# EAGLE design gps (EAGLE 9.3.0)
AUTHOR: PY2RAF; REVISION: A
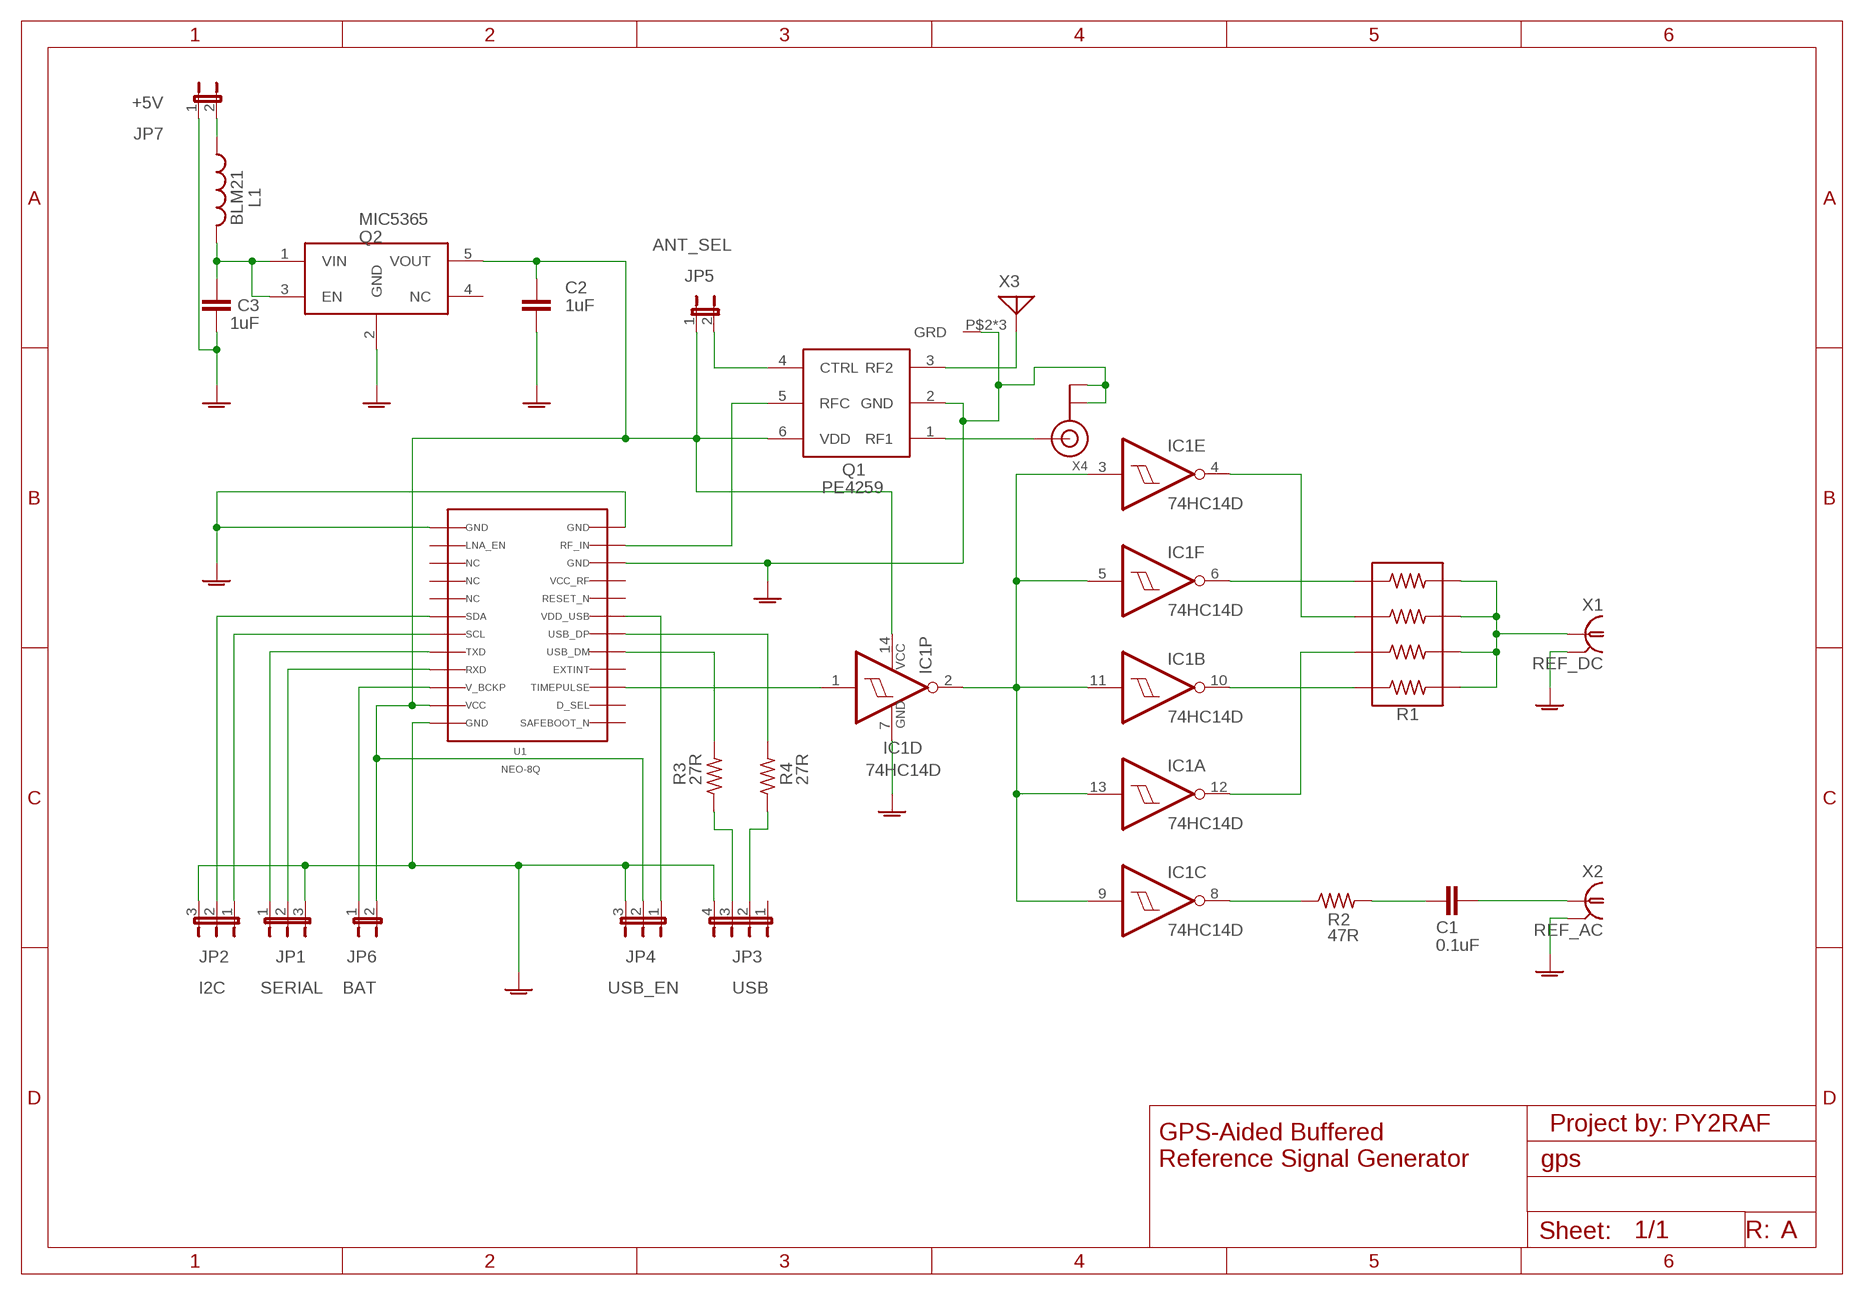
[diagram p0: schematic, sheet 1]

## Parts
C1  0.1uF  C-EUC1206  [C1206]
C2  1uF  C-EUC1206  [C1206]
C3  1uF  C-EUC1206  [C1206]
IC1  74HC14D  [SO14]
JP1  SERIAL  JP2E  [JP2]
JP2  I2C  JP2E  [JP2]
JP3  USB  JP4E  [JP4]
JP4  USB_EN  JP2E  [JP2]
JP5  ANT_SEL  JP1E  [JP1]
JP6  BAT  JP1E  [JP1]
JP7  +5V  JP1E  [JP1]
L1  BLM21  L-USL2012C  [L2012C]
Q1  PE4259  [SC-70]
Q2  MIC5365  [SOT23-5L]
R1  744C083  [1206X4]
R2  47R  R-US_M1206  [M1206]
R3  27R  R-US_M1206  [M1206]
R4  27R  R-US_M1206  [M1206]
U1  NEO-8Q  NEO-8  [NEO-7]
X1  REF_DC  SMA-PCB  [SMA-RF]
X2  REF_AC  SMA-PCB  [SMA-RF]
X3  ANT-GNSS-MLX  [MOLEX-GNSS]
X4  ANTENNA_U.FL  [U.FL]

## Nets
GNDA: C2.2 C3.2 IC1.7(P:GND) JP1.3 JP2.3 JP3.4 JP4.3 JP7.1 Q1.2(GND) Q2.2(GND) U1.10 U1.12 U1.13 U1.24 X1.2 X1.3 X1.4 X1.5 X2.2 X2.3 X2.4 X2.5 X3.P$2(GRD) X3.P$3(GRD) X3.P$4(GRD) X4.1(GND) X4.2(GND)
N$1: IC1.2(D:O) IC1.3(E:I) IC1.5(F:I) IC1.9(C:I) IC1.11(B:I) IC1.13(A:I)
N$2: IC1.4(E:O) R1.P$3
N$3: IC1.12(A:O) R1.P$2
N$4: IC1.10(B:O) R1.P$1
N$5: IC1.6(F:O) R1.P$4
N$6: IC1.1(D:I) U1.3
N$7: IC1.8(C:O) R2.1
N$8: C1.2 R2.2
N$9: R3.2 U1.5
N$10: R4.2 U1.6
N$11: C1.1 X2.1
N$12: JP4.1 U1.7
N$13: JP3.3 R3.1
N$14: JP3.2 R4.1
N$15: JP2.2 U1.18
N$16: JP2.1 U1.19
N$17: JP1.2 U1.21
N$18: JP1.1 U1.20
N$19: JP6.1 U1.22
N$20: JP5.2 Q1.4(CTRL)
N$21: R1.P$5 R1.P$6 R1.P$7 R1.P$8 X1.1
N$22: C2.1 IC1.14(P:VCC) JP4.2 JP5.1 JP6.2 Q1.6(VDD) Q2.5(VOUT) U1.23
N$23: Q1.5(RFC) U1.11
N$24: C3.1 L1.2 Q2.1(VIN) Q2.3(EN)
N$25: JP7.2 L1.1
N$26: Q1.3(RF2) X3.P$1(ANT)
N$27: Q1.1(RF1) X4.3(SIGNAL)
Unconnected: JP3.1 Q2.4(NC) U1.1 U1.2 U1.4 U1.8 U1.9 U1.14 U1.15 U1.16 U1.17

## Notes on the sheet
- Project by:
- GPS-Aided Buffered
  Reference Signal Generator
- R:

## Library data of the parts
C1-C3 = rcl:C-EU: CAPACITOR, European symbol; SPICEPREFIX: C
IC1 = 74xx-eu:74*14: Hex schmitt trigger INVERTER
JP1 JP2 JP4 = jumper:JP2E: JUMPER
JP3 = jumper:JP4E: JUMPER
JP5-JP7 = jumper:JP1E: JUMPER
L1 = rcl:L-US: INDUCTOR, American symbol; SPICEPREFIX: L
Q1 = aarf:PE4259: PE4259 SPDT High Power UltraCMOS 10 MHz 3.0 GHz RF Switch Features - High ESD tolerance of 2 kV HBM - Single-pin or complementary CMOS logic control inputs - Low insertion loss: * 0.35 dB @ 1000 MHz * 0.5 dB @ 2000 MHz - Isolation of 30 dB @ 1000 MHz - Typical input 1 dB compression point of +33.5 dBm - 1.8V minimum power supply voltage - Ultra-small SC-70 package
Q2 = aarf:MIC5365
R1 = aarf:744C083
R2-R4 = rcl:R-US_: RESISTOR, American symbol; SPICEPREFIX: R
U1 = aarf:NEO-8
X1 X2 = aarf:SMA-PCB
X3 = aarf:ANT-GNSS-MLX
X4 = adafruit:ANTENNA_U.FL: U.FL Antenna Connector

## Board
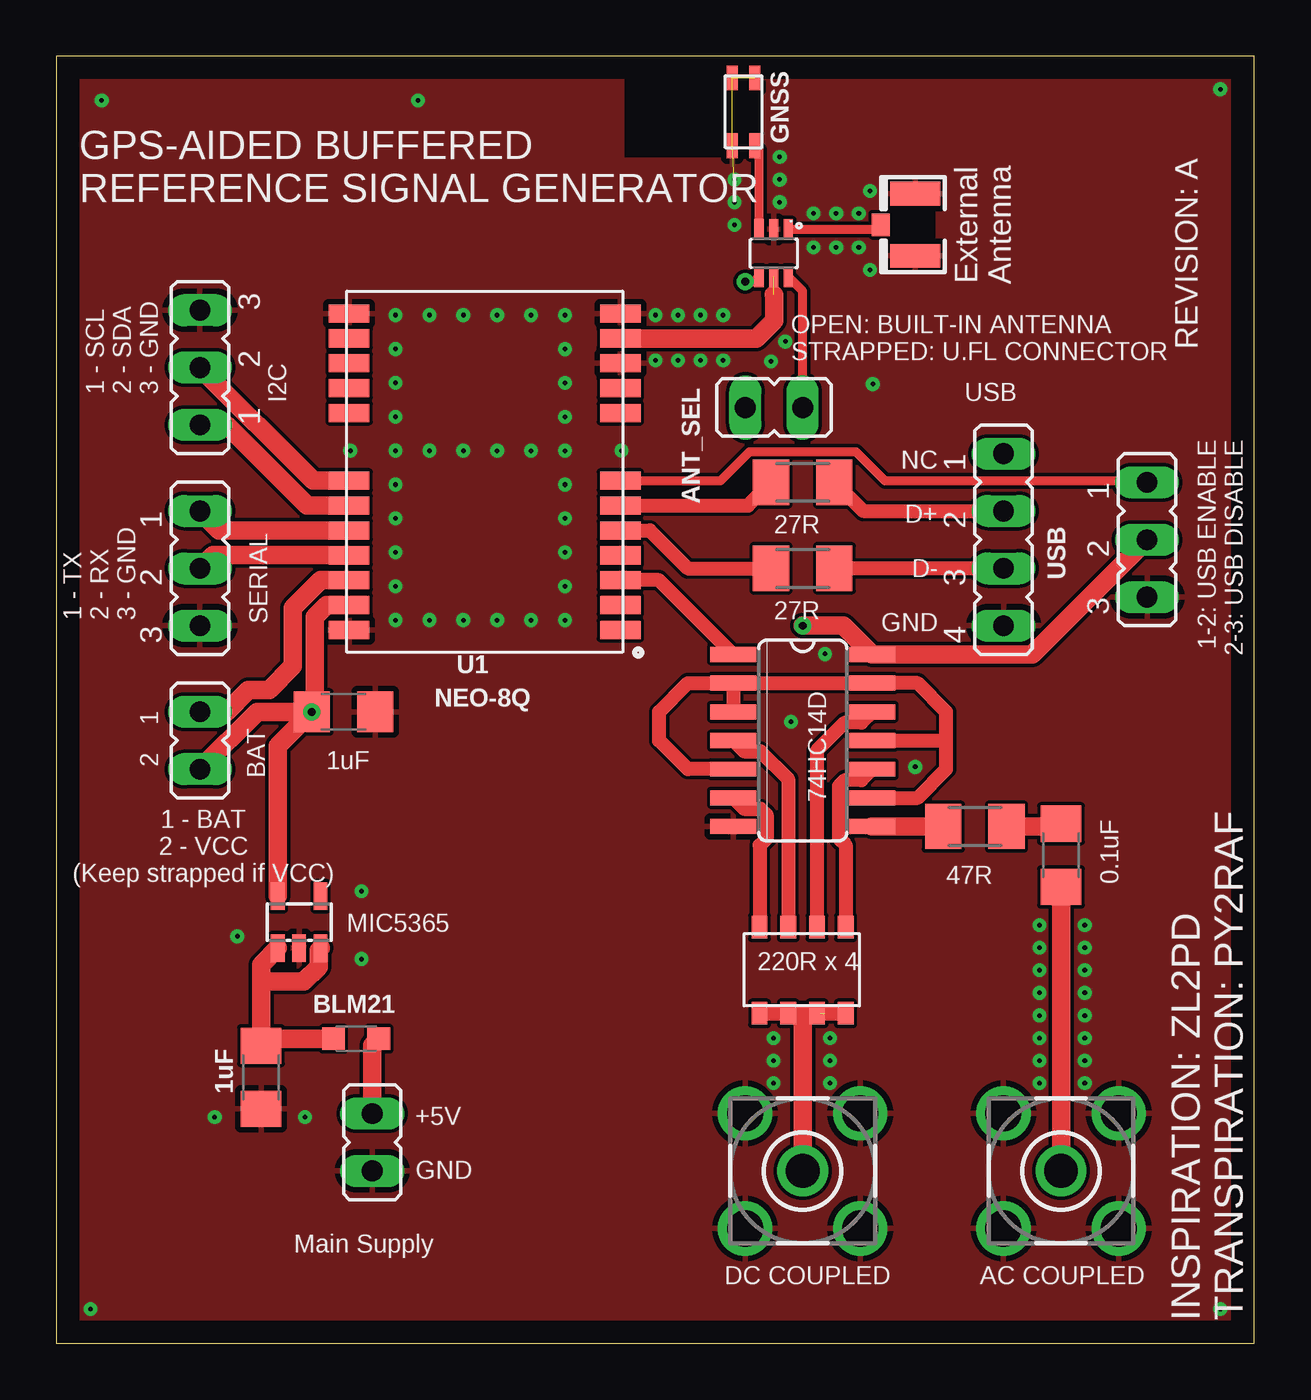
[diagram p1: board, top side]
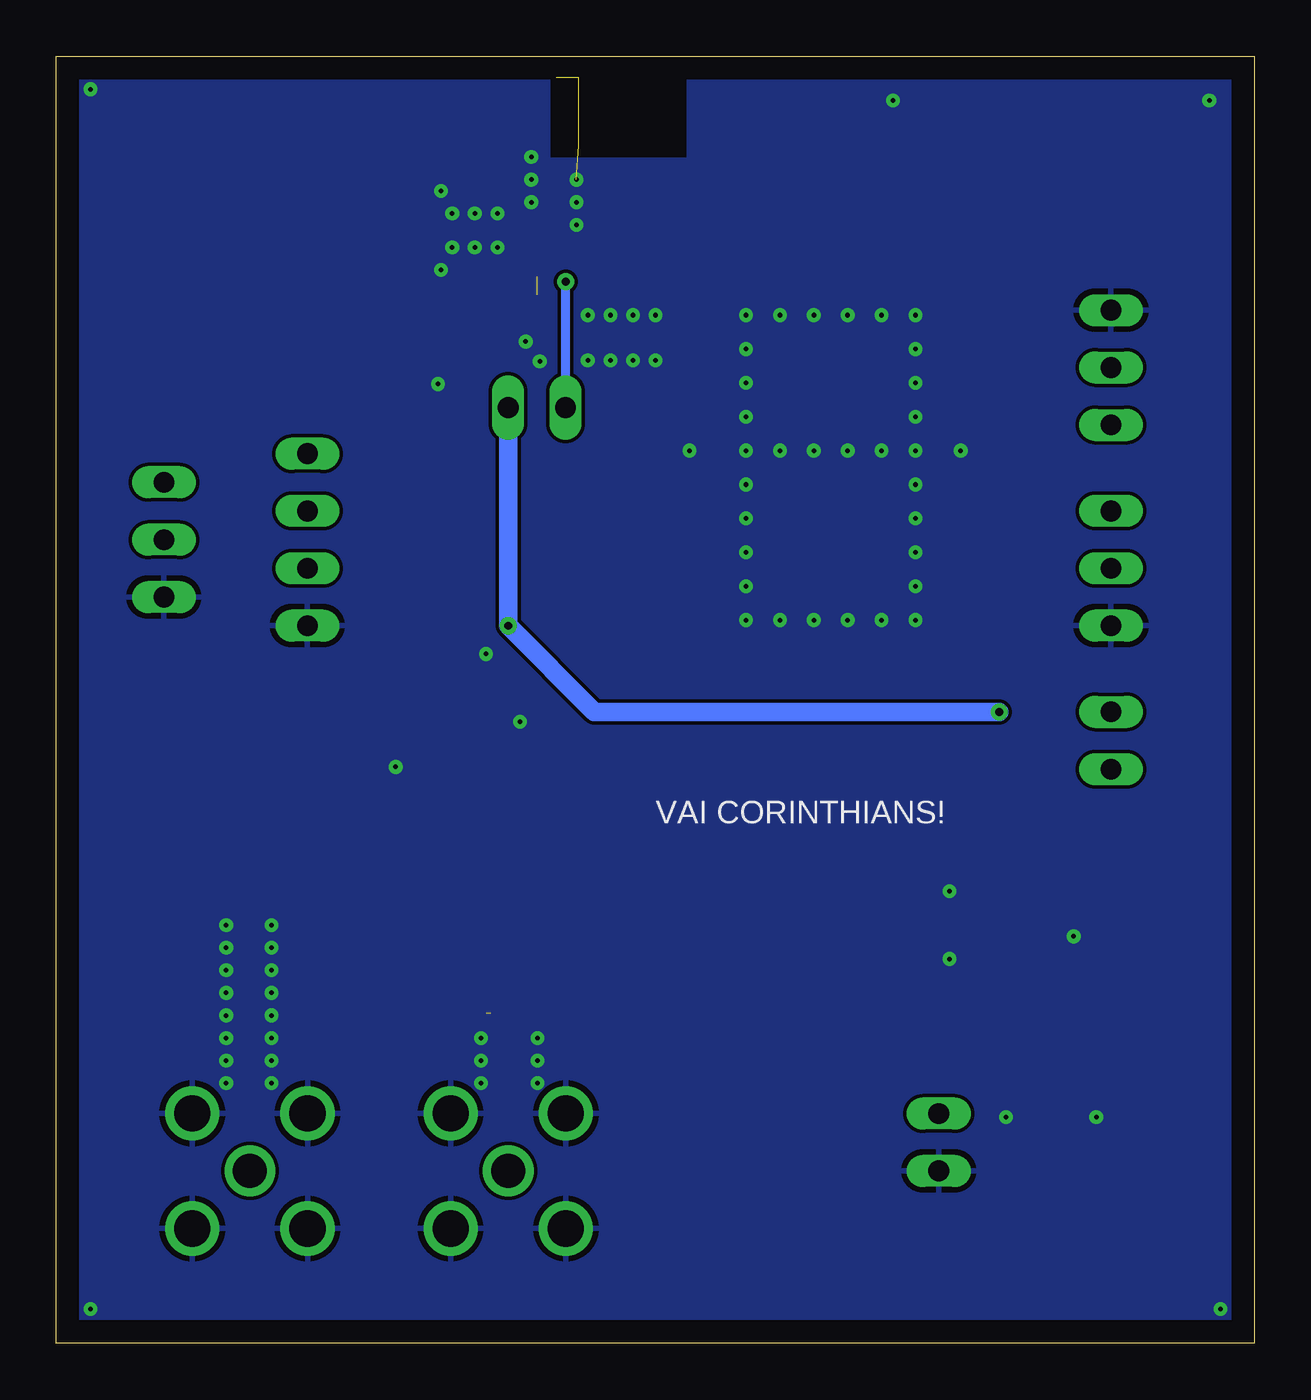
[diagram p2: board, bottom side, seen from below]

Size 53.01 x 56.95 mm. Coordinates in mm from the lower left corner, seen from the top.
Outline: 0,0 53.01,0 53.01,56.95 0,56.95 0,0
Copper layers (1*16): Top 0.035mm / dielectric 1.5mm / Bottom 0.035mm
Design rules "default *": minimum track width 6mil, minimum drill 0.35mm, track to track 6mil, track to pad 6mil, pad to pad 6mil, via to via 6mil, smd to smd 6mil, copper to edge 40mil, drill to drill 6mil, minimum pad ring 10mil, minimum via ring 8mil, stop-mask expansion 4mil, vias tented up to drill 10mil, thermal gap 10mil
tRestrict: area 25.1,52.5 to 31.1,56.5
bRestrict: area 25.1,52.5 to 31.1,56.5

### Footprints (pad centres in the part's own frame; a part is rotated, then mirrored left to right if it is on the bottom)
C1206 = smd 1.6 x 1.8: 1 -1.4,0; 2 1.4,0
SO14 = smd 0.66 x 2.032: 1 -3.81,-3.073; 2 -2.54,-3.073; 3 -1.27,-3.073; 4 0,-3.073; 5 1.27,-3.073; 6 2.54,-3.073; 7 3.81,-3.073; 8 3.81,3.073; 9 2.54,3.073; 10 1.27,3.073; 11 0,3.073; 12 -1.27,3.073; 13 -2.54,3.073; 14 -3.81,3.073
JP2 = drill 0.914 long: 1 -2.54,0; 2 0,0; 3 2.54,0
JP4 = drill 0.914 long: 1 -3.81,0; 2 -1.27,0; 3 1.27,0; 4 3.81,0
JP1 = drill 0.914 long: 1 0,-1.27; 2 0,1.27
L2012C = smd 1 x 1: 1 -1,0; 2 1,0
SC-70 = smd 0.4 x 0.9: 1 -0.635,-1.035; 2 0.015,-1.035; 3 0.665,-1.035; 4 0.665,1.065; 5 0.015,1.065; 6 -0.635,1.065
SOT23-5L = smd 0.6 x 1.2: 1 -0.95,-1.15; 2 0,-1.15; 3 0.95,-1.15; 4 0.95,1.15; 5 -0.95,1.15
1206X4 = smd 0.7 x 1: P$1 -1.9,-1.9; P$2 -0.63,-1.9; P$3 0.64,-1.9; P$4 1.91,-1.9; P$5 1.91,1.91; P$6 0.64,1.91; P$7 -0.63,1.91; P$8 -1.9,1.91
M1206 = smd 1.6 x 2: 1 -1.4,0; 2 1.4,0
NEO-7 = smd 1.8 x 0.8: 1 5.9,-7.8; 2 5.9,-6.7; 3 5.9,-5.6; 4 5.9,-4.5; 5 5.9,-3.4; 6 5.9,-2.3; 7 5.9,-1.2; 8 5.9,1.8; 9 5.9,2.9; 10 5.9,4; 11 5.9,5.1; 12 5.9,6.2; 13 -6.1,6.2; 14 -6.1,5.1; 15 -6.1,4; 16 -6.1,2.9; 17 -6.1,1.8; 18 -6.1,-1.2; 19 -6.1,-2.3; 20 -6.1,-3.4; 21 -6.1,-4.5; 22 -6.1,-5.6; 23 -6.1,-6.7; 24 -6.1,-7.8
SMA-RF = drill 1.5: 1 0,0 | drill 1.6: 2 -2.55,2.55; 3 2.55,2.55; 4 2.55,-2.55; 5 -2.55,-2.55
MOLEX-GNSS = smd 1.1 x 0.5: P$1 -1.5,-0.4; P$2 -1.5,0.6; P$3 1.5,0.6; P$4 1.5,-0.4
U.FL = smd 2.2 x 1.05: 1 0,1.375; 2 0,-1.375 | smd 0.8 x 1: 3 1.525,0

### Placement (x,y rotation side)
C1  44.45,21.59 90 top
C2  12.7,27.94 0 top
C3  9.05,11.76 270 top
IC1  33.02,26.67 270 top
JP1  6.35,34.29 270 top
JP2  6.35,43.18 90 top
JP3  41.91,35.56 270 top
JP4  48.26,35.56 270 top
JP5  31.75,41.41 90 top
JP6  6.35,26.67 180 top
JP7  13.97,8.89 0 top
L1  13.26,13.47 180 top
Q1  31.75,48.26 180 top
Q2  10.74,18.63 0 top
R1  33.02,16.51 180 top
R2  40.64,22.86 0 top
R3  33.02,34.29 180 top
R4  33.02,38.1 180 top
U1  19.05,39.37 0 top
X1  33.02,7.62 0 top
X2  44.45,7.62 0 top
X3  30.5,54.5 90 top
X4  38,49.5 180 top

### Tracks (layer width: path | path; a pad name or v marks a point on that pad's centre or on a via)
GNDA  (via drill 0.2)  (3 unrouted)
  other vias: 26.5,45.5 26.5,43.5 27.5,43.5 28.5,43.5 28.5,45.5 27.5,45.5 29.5,45.5 29.5,43.5 36.12,42.45 30,49.5 30,50.5 30,51.5 32,51.5 32,50.5 33.5,50 34.5,50 34.5,48.5 33.5,48.5 15,45.5 15,44 15,42.5 15,41 15,39.5 15,38 15,36.5 15,35 15,33.5 15,32 16.5,32 18,32 19.5,32 21,32 22.5,32 22.5,33.5 22.5,35 22.5,36.5 22.5,38 22.5,39.5 22.5,41 22.5,42.5 22.5,44 22.5,45.5 21,45.5 19.5,45.5 18,45.5 16.5,45.5 25,39.5 13,39.5 45.5,18.5 45.5,17.5 45.5,16.5 45.5,15.5 45.5,14.5 45.5,13.5 45.5,12.5 45.5,11.5 43.5,11.5 43.5,12.5 43.5,13.5 43.5,14.5 43.5,15.5 43.5,16.5 43.5,17.5 43.5,18.5 31.73,13.5 31.73,12.5 31.73,11.5 34.23,11.5 34.23,12.5 34.23,13.5 16.5,39.5 18,39.5 19.5,39.5 21,39.5 32.5,27.5 34,30.5 13.5,17 13.5,20 2,55 16,55 35.5,50 35.5,48.5 51.5,55.5 51.5,1.5 1.5,1.5 31.62,43.45 32.25,44.33 36,47.5 36,51 32,52.5 7,10 11,10 8,18 38,25.5
  pour Top: 0,56.96 0,0 53.34,0 53.34,56.96
  pour Bottom: 0,56.96 0,0 53.34,0 53.34,56.96
N$1
  Top 0.61: IC1.2 IC1.3 | IC1.2 IC1.13 38.1,29.21 39.37,27.94 39.37,26.67 | IC1.9 38.1,24.13 39.37,25.4 39.37,26.67 | IC1.11 39.37,26.67 | IC1.5 27.94,25.4 26.67,26.67 26.67,27.94 27.94,29.21 IC1.2
N$2
  Top 0.61: IC1.4 30.43,26.19 31.15,26.19 32.38,24.96 R1.P$3
N$3
  Top 0.61: IC1.12 35.61,27.46 34.89,27.46 33.65,26.22 R1.P$2
N$4
  Top 0.61: IC1.10 35.61,24.92 34.89,24.92 34.62,24.65 34.62,22.34 34.92,22.04 R1.P$1
N$5
  Top 0.61: IC1.6 30.43,23.65 31.15,23.65 31.42,23.38 31.42,22.34 31.11,22.03 R1.P$4
N$6
  Top 0.61: IC1.1 26.66,33.77 U1.3
N$7
  Top 0.813: IC1.8 R2.1
N$8
  Top 0.61: R2.2 42.17,22.99
  Top 0.813: R2.2 44.32,22.86 C1.2
N$9
  Top 0.61: U1.5 26.26,35.97 27.94,34.29 R3.2
N$10
  Top 0.61: U1.6 30.59,37.07 R4.2
N$11
  Top 0.813: X2.1 C1.1
N$12
  Top 0.406: JP4.1 48.19,38.17 36.65,38.17 35.37,39.46 30.67,39.46 29.39,38.17 U1.7
N$13
  Top 0.61: JP3.3 R3.1
N$14
  Top 0.61: R4.1 35.69,36.83 JP3.2
N$15
  Top 0.813: JP2.2 11.36,38.17 U1.18
N$16
  Top 0.813: JP2.1 7.53,40.64 11.1,37.06 11.11,37.07 U1.19
N$17
  Top 0.813: U1.21 6.93,34.87 JP1.2
N$18
  Top 0.813: U1.20 7.21,35.97 JP1.1
N$19
  Top 0.813: U1.22 11.7,33.77 10.46,32.54 10.46,29.96 9.4,28.91 8.49,28.91 7.53,27.94 JP6.1
N$20  (via drill 0.35)
  Top 0.406: v30.48,46.99 30.88,46.99 Q1.4
  Bottom 0.406: JP5.2 v30.48,46.99
N$21  (1 unrouted)
  Top 0.61: R1.P$5 R1.P$6 33,14.6 R1.P$7 33.79,14.6 | 34,14.6 R1.P$8
  Top 0.813: X1.1 33.02,14.58 33,14.6
N$22  (via drill 0.35)
  Top 0.406: JP5.1 33.02,46.56 Q1.6
  Top 0.813: 11.63,27.94 C2.1 | C2.1 11.43,28.07 11.43,32.14 11.96,32.67 U1.23 | JP6.2 8.89,27.94 C2.1 | v33.02,31.75 34.82,31.75 IC1.14 43.18,30.48 JP4.2 | Q2.5 9.79,26.43 C2.1
  Bottom 0.813: C2.1 29.21,27.94 v33.02,31.75 JP5.1
  other vias: 11.3,27.94
N$23  (1 unrouted)
  Top 0.813: U1.11 30.97,44.47 31.75,45.25 31.75,46.39 31.73,46.41
N$24
  Top 0.813: L1.2 9.36,13.47 C3.1 9.05,16 | 9.05,16 9.05,16.74 Q2.1 | Q2.3 11.6,17.39 11.6,16.65 10.95,16 9.05,16
N$25
  Top 0.813: L1.1 13.97,13.18 JP7.2
N$26
  Top 0.406: X3.P$1 31.09,52.81 Q1.3
N$27
  Top 0.406: Q1.1 36.27,49.3 X4.3

### Text on the board
tPlace: GPS-AIDED BUFFERED / REFERENCE SIGNAL GENERATOR | External / Antenna | OPEN: BUILT-IN ANTENNA / STRAPPED: U.FL CONNECTOR | REVISION: | 1 - SCL / 2 - SDA / 3 - GND | USB | NC / / D+ / / D- / / GND | 1-2: USB ENABLE / 2-3: USB DISABLE | 1 - TX / 2 - RX / 3 - GND | 2 1 | 1 - BAT / 2 - VCC / (Keep strapped if VCC) | 220R x 4 | +5V / / GND | Main Supply | DC COUPLED | AC COUPLED | INSPIRATION: ZL2PD / TRANSPIRATION: PY2RAF
bPlace: VAI CORINTHIANS!